# Altium schematic sheet v1.0.SchDoc
size 55 x 44 mm
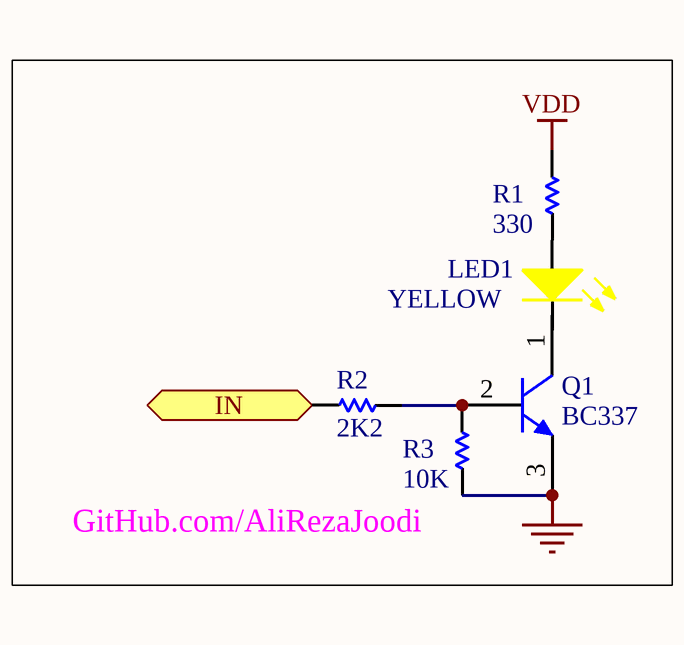
[diagram p0: v1.0.SchDoc]

## Parts
LED1  YELLOW  [LED_THD_3MM_YELLOW_R]
Q1  BC337  [TO92_3Pin_Form3]
R1  330  [R_THD_AXIAL0.4(1/4W)]
R2  2K2  [R_THD_AXIAL0.4(1/4W)]
R3  10K  [R_THD_AXIAL0.4(1/4W)]

## Ports
IN (in)

## Nets
GND: Q1.3(E) R3.1
VDD: R1.2
IN: R2.1 ; port IN
NetLED1_1: LED1.1(A) R1.1
NetQ1_2: Q1.2(B) R2.2 R3.2

Not connected (* = marked no-connect by the designer): LED1 2(K); Q1 1(C)

## Notes on the sheet
- (near R3) GitHub.com/AliRezaJoodi

## Library data of the parts
LED1 = LED_YELLOW: LED, Yellow; Manufacturer: Generic Components; Class I: Optoelectronic; Published: 8-Jun-2000; Revision: July-2002: Re-released for DXP Platform.; Publisher: Altium Limited; Class II: LED
Q1 = Transistor_BJT_NPN: Transistor, BJT, NPN; Package Reference: TO-92A
R1-R3 = Resistor: Revision: July-2002: Re-released for DXP Platform.